# EAGLE design pi-hat-v.02-sparkfun (EAGLE 8.2.2)
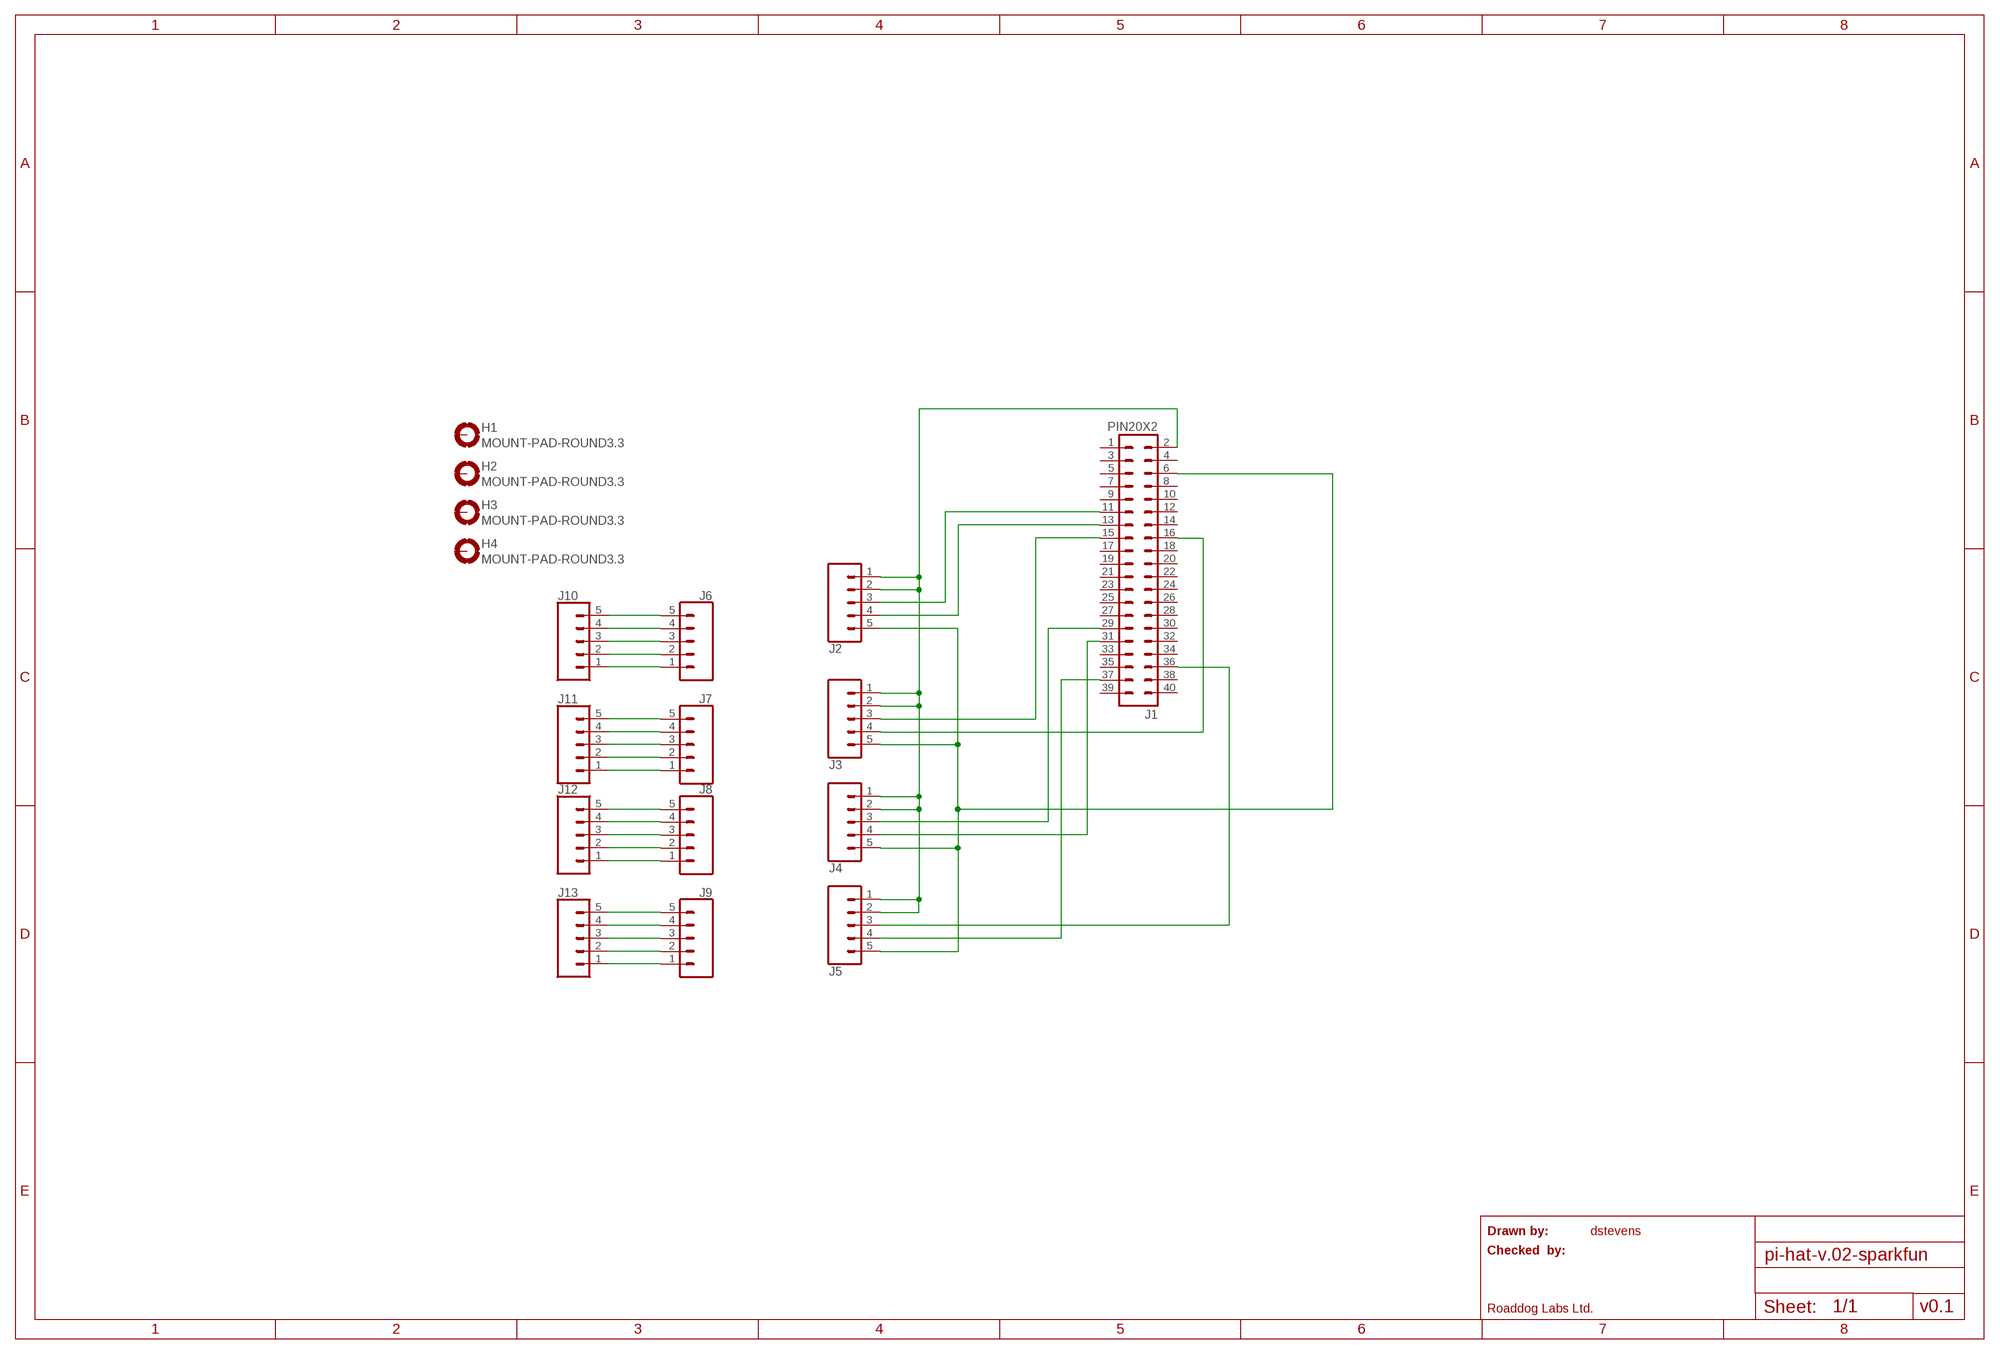
[diagram p0: schematic, sheet 1]

## Parts
H1  MOUNT-PAD-ROUND3.3  [3,3-PAD]
H2  MOUNT-PAD-ROUND3.3  [3,3-PAD]
H3  MOUNT-PAD-ROUND3.3  [3,3-PAD]
H4  MOUNT-PAD-ROUND3.3  [3,3-PAD]
J1  PIN20X2  [PIN_20X2]
J2  CONN_05  [1X05]
J3  CONN_05  [1X05]
J4  CONN_05  [1X05]
J5  CONN_05  [1X05]
J6  CONN_05  [1X05]
J7  CONN_05  [1X05]
J8  CONN_05  [1X05]
J9  CONN_05  [1X05]
J10  CONN_05  [1X05]
J11  CONN_05  [1X05]
J12  CONN_05  [1X05]
J13  CONN_05  [1X05]

## Nets
N$1: J6.5 J10.5
N$2: J6.4 J10.4
N$3: J6.3 J10.3
N$4: J6.2 J10.2
N$5: J6.1 J10.1
N$6: J7.5 J11.5
N$7: J7.4 J11.4
N$8: J7.3 J11.3
N$9: J7.2 J11.2
N$10: J7.1 J11.1
N$11: J8.5 J12.5
N$12: J8.4 J12.4
N$13: J8.3 J12.3
N$14: J8.2 J12.2
N$15: J8.1 J12.1
N$16: J9.5 J13.5
N$17: J1.2 J2.1 J2.2 J3.1 J3.2 J4.1 J4.2 J5.1 J5.2
N$18: J1.6 J2.5 J3.5 J4.5 J5.5
N$19: J1.11 J2.3
N$20: J1.13 J2.4
N$21: J1.15 J3.3
N$22: J1.16 J3.4
N$23: J1.37 J5.4
N$24: J1.36 J5.3
N$25: J1.31 J4.4
N$26: J1.29 J4.3
N$27: J9.4 J13.4
N$28: J9.3 J13.3
N$29: J9.2 J13.2
N$30: J9.1 J13.1
Unconnected: H1.B3,3(MOUNT) H2.B3,3(MOUNT) H3.B3,3(MOUNT) H4.B3,3(MOUNT) J1.1 J1.3 J1.4 J1.5 J1.7 J1.8 J1.9 J1.10 J1.12 J1.14 J1.17 J1.18 J1.19 J1.20 J1.21 J1.22 J1.23 J1.24 J1.25 J1.26 J1.27 J1.28 J1.30 J1.32 J1.33 J1.34 J1.35 J1.38 J1.39 J1.40

## Notes on the sheet
- Drawn by: | dstevens
- Checked  by:
- Roaddog Labs Ltd. | v0.1

## Library data of the parts
H1-H4 = holes:MOUNT-PAD-ROUND: MOUNTING PAD, round
J1 = FLYFISH:PIN20X2
J2-J13 = SparkFun-Connectors:CONN_05: Multi connection point. Often used as Generic Header-pin footprint for 0.1 inch spaced/style header connections On any of the 0.1 inch spaced packages, you can populate with these: Break Away Headers - Straight <https://www.sparkfun.com/products/116> (PRT-00116) Break Away Male Headers - Right Angle <https://www.sparkfun.com/products/553> (PRT-00553) Female Headers <https://www.sparkfun.com/products/115> (PRT-00115) Break Away Headers - Machine Pin <https://www.sparkfun.com/products/117> (PRT-00117) Break Away Female Headers - Swiss Machine Pin <https://www.sparkfun.com/products/743> (PRT-00743) For SCREWTERMINALS and SPRING TERMINALS visit here: Screw Terimnals on SparkFun.com <https://www.sparkfun.com/search/results?term=Screw+Terminals> (5mm/3.5mm/2.54mm spacing) This device is also useful as a general connection point to wire up your design to another part of your project. Our various solder wires solder well into these plated through hole pads. Hook-Up Wire - Assortment (Stranded, 22 AWG) <https://www.sparkfun.com/products/11375> (PRT-11375) Hook-Up Wire - Assortment (Solid Core, 22 AWG) <https://www.sparkfun.com/products/11367> (PRT-11367) View the entire wire category on our website here <https://www.sparkfun.com/categories/141> Special notes: Molex polarized connector foot print use with SKU : PRT-08231 with associated crimp pins and housings. 1MM SMD Version SKU: PRT-10208

## Board
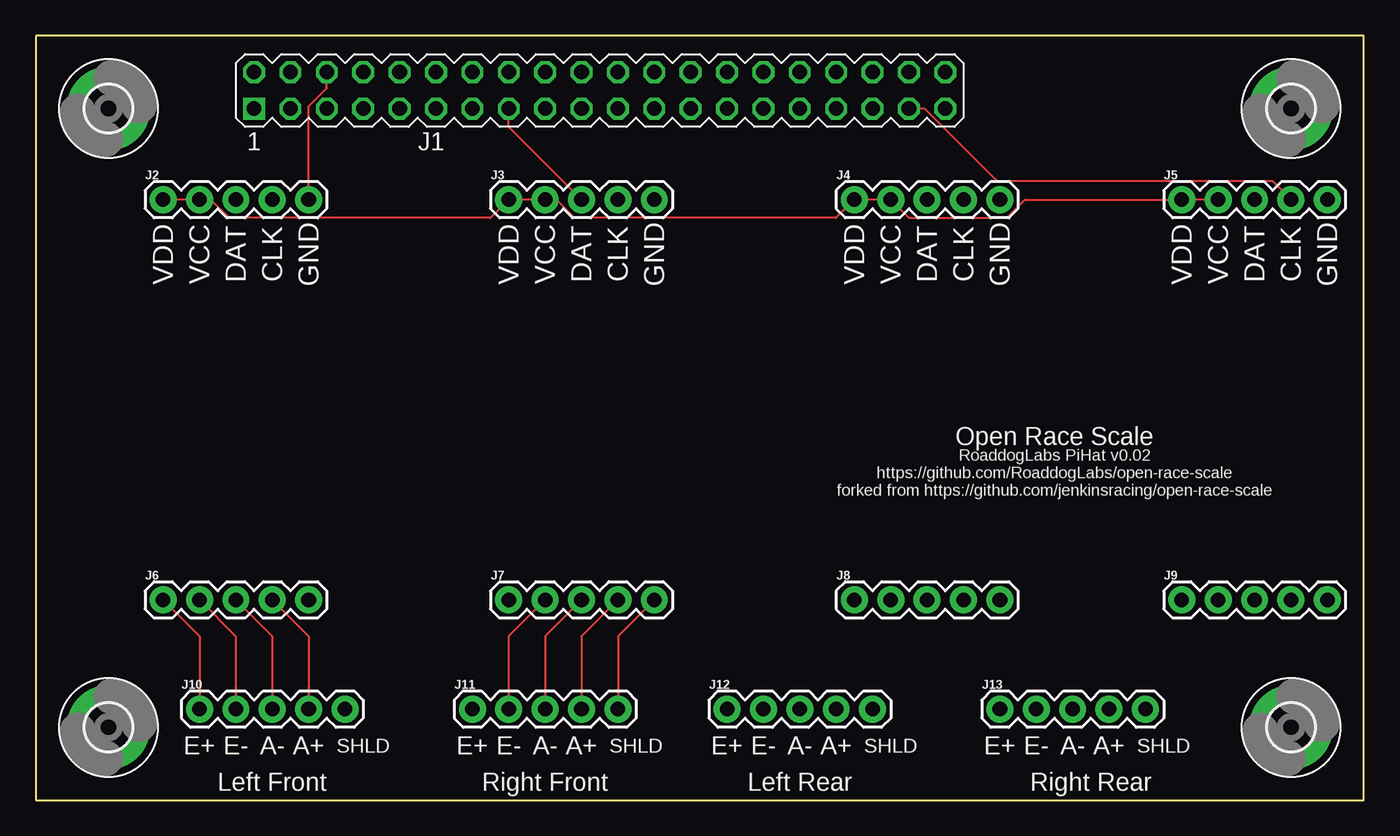
[diagram p1: board, top side]
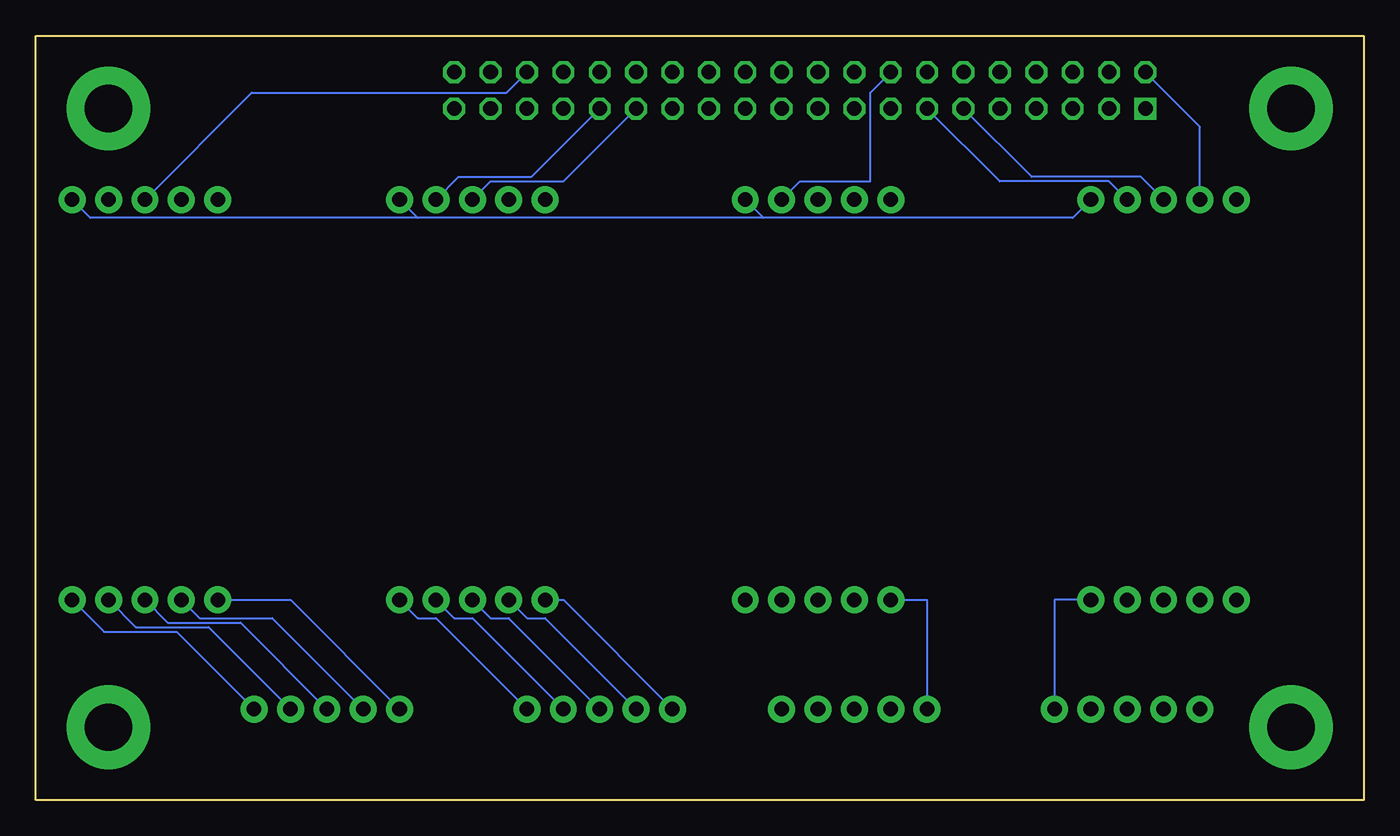
[diagram p2: board, bottom side, seen from below]

Size 92.71 x 53.34 mm. Coordinates in mm from the lower left corner, seen from the top.
Outline: 0,0 92.71,0 92.71,53.34 0,53.34 0,0
Copper layers (1*16): Top 0.035mm / dielectric 1.5mm / Bottom 0.035mm
Design rules "SeeedStudio_2layer_DRU_no_angle_20140221": minimum track width 6mil, minimum drill 12mil, track to track 6mil, track to pad 6mil, pad to pad 6mil, via to via 6mil, smd to smd 0mil, copper to edge 10mil, drill to drill 10mil, minimum pad ring 10mil, minimum via ring 6mil, stop-mask expansion 2mil, vias tented up to drill 100mil, thermal gap 10mil

### Footprints (pad centres in the part's own frame; a part is rotated, then mirrored left to right if it is on the bottom)
3,3-PAD = drill 3.3 pad 5.842: B3,3 0,0
PIN_20X2 = drill 1.016 square: 1 -24.13,-1.27 | drill 1.016 octagon: 2 -24.13,1.27; 3 -21.59,-1.27; 4 -21.59,1.27; 5 -19.05,-1.27; 6 -19.05,1.27; 7 -16.51,-1.27; 8 -16.51,1.27; 9 -13.97,-1.27; 10 -13.97,1.27; 11 -11.43,-1.27; 12 -11.43,1.27; 13 -8.89,-1.27; 14 -8.89,1.27; 15 -6.35,-1.27; 16 -6.35,1.27; 17 -3.81,-1.27; 18 -3.81,1.27; 19 -1.27,-1.27; 20 -1.27,1.27; 21 1.27,-1.27; 22 1.27,1.27; 23 3.81,-1.27; 24 3.81,1.27; 25 6.35,-1.27; 26 6.35,1.27; 27 8.89,-1.27; 28 8.89,1.27; 29 11.43,-1.27; 30 11.43,1.27; 31 13.97,-1.27; 32 13.97,1.27; 33 16.51,-1.27; 34 16.51,1.27; 35 19.05,-1.27; 36 19.05,1.27; 37 21.59,-1.27; 38 21.59,1.27; 39 24.13,-1.27; 40 24.13,1.27
1X05 = drill 1.016 pad 1.88: 1 0,0; 2 2.54,0; 3 5.08,0; 4 7.62,0; 5 10.16,0

### Placement (x,y rotation side)
H1  5.08,48.26 0 top
H2  87.63,48.26 0 top
H3  5.08,5.08 0 top
H4  87.63,5.08 0 top
J1  39.37,49.53 0 top
J2  8.89,41.91 0 top
J3  33.02,41.91 0 top
J4  57.15,41.91 0 top
J5  80.01,41.91 0 top
J6  8.89,13.97 0 top
J7  33.02,13.97 0 top
J8  57.15,13.97 0 top
J9  80.01,13.97 0 top
J10  11.43,6.35 0 top
J11  30.48,6.35 0 top
J12  48.26,6.35 0 top
J13  67.31,6.35 0 top

### Tracks (layer width: path | path; a pad name or v marks a point on that pad's centre or on a via)
N$1
  Bottom 0.152: J10.5 21.59,13.97 J6.5
N$2
  Top 0.152: J10.4 19.05,11.43 J6.4
N$3
  Top 0.152: J10.3 16.51,11.43 J6.3
N$4
  Top 0.152: J10.2 13.97,11.43 J6.2
N$5
  Top 0.152: J10.1 11.43,11.43 J6.1
N$6
  Top 0.152: J11.5 40.64,11.43 J7.5
N$7
  Top 0.152: J11.4 38.1,11.43 J7.4
N$8
  Top 0.152: J11.3 35.56,11.43 J7.3
N$9
  Top 0.152: J11.2 33.02,11.43 J7.2
N$10
  Bottom 0.152: J11.1 30.48,13.97 J7.1
N$11
  Bottom 0.152: J12.5 64.77,12.7 66.04,12.7 J8.5
N$12
  Bottom 0.152: J12.4 62.23,12.7 63.5,12.7 J8.4
N$13
  Bottom 0.152: J12.3 59.69,12.7 60.96,12.7 J8.3
N$14
  Bottom 0.152: J12.2 57.15,12.7 58.42,12.7 J8.2
N$15
  Bottom 0.152: J12.1 55.88,13.97 J8.1
N$16
  Bottom 0.152: J13.5 82.87,11.75 87.95,11.75 J9.5
N$17
  Top 0.152: J2.1 J2.2 12.22,41.91 13.49,40.64 31.75,40.64 J3.1 J3.2 36.35,41.91 37.62,40.64 55.88,40.64 J4.1 J4.2 60.96,40.64 67.79,40.64 69.06,41.91 J5.1 J5.2
  Bottom 0.152: J1.2 11.43,46.99 J2.2
N$18
  Top 0.152: J1.6 20.32,49.69 19.05,48.42 J2.5
  Bottom 0.152: 41.91,40.64 J3.5 | 41.91,40.64 20.32,40.64 J2.5 | 66.04,40.64 J4.5 | 41.91,40.64 66.04,40.64 | J5.5 88.9,40.64 66.04,40.64
N$19
  Bottom 0.152: J1.11 23.18,43.5 15.56,43.5 J2.3
N$20
  Bottom 0.152: J1.13 25.4,43.18 17.78,43.18 J2.4
N$21
  Top 0.152: J1.15 33.02,46.99 J3.3
N$22
  Bottom 0.152: J1.16 34.45,49.37 34.45,43.18 39.37,43.18 J3.4
N$23
  Top 0.152: J1.37 62.07,48.26 67.15,43.18 86.36,43.18 J5.4
N$24
  Bottom 0.152: J1.36 59.85,49.37 77.63,49.37 J5.3
N$25
  Bottom 0.152: J1.31 58.1,43.5 63.18,43.5 J4.4
N$26
  Bottom 0.152: J1.29 55.88,43.18 60.96,43.18 J4.3
N$27
  Bottom 0.152: J13.4 80.64,12.06 85.72,12.06 J9.4
N$28
  Bottom 0.152: J13.3 78.42,12.38 83.5,12.38 J9.3
N$29
  Bottom 0.152: J13.2 76.2,12.7 81.28,12.7 J9.2
N$30
  Bottom 0.152: J13.1 74.93,13.97 J9.1

### Text on the board
tPlace: VDD | VCC | DAT | CLK | GND | VDD | VCC | DAT | CLK | GND | VDD | VCC | DAT | CLK | GND | VDD | VCC | DAT | CLK | GND | Open Race Scale | RoaddogLabs PiHat v0.02 / https://github.com/RoaddogLabs/open-race-scale / forked from https://github.com/jenkinsracing/open-race-scale | E+ | E- | A- | A+ | SHLD | E+ | E- | A- | A+ | SHLD | E+ | E- | A- | A+ | SHLD | E+ | E- | A- | A+ | SHLD | Left Front | Right Front | Left Rear | Right Rear